# Altium project DBD_plasma.PrjPcb
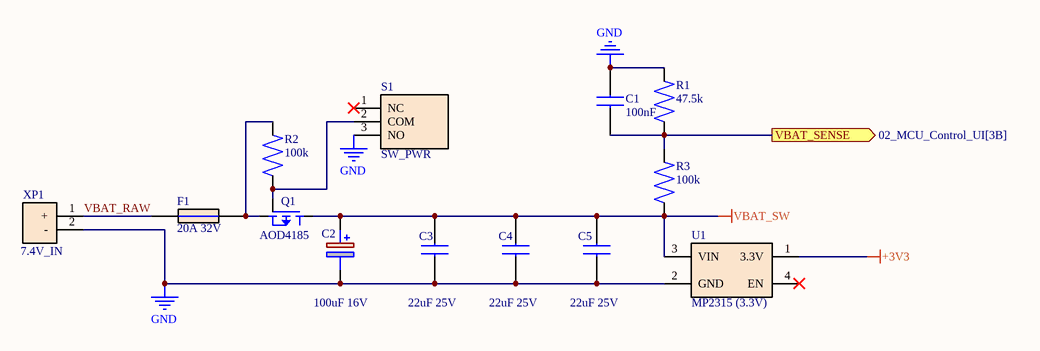
[diagram p0: 01_Power_Input.SchDoc]
6 sheets, 123 parts. Net scope: flat (ports and power ports of the same name join across sheets).
Board file: DBD_plasma.PcbDoc
Sheets:
  01_Power_Input.SchDoc
  02_MCU_Control_UI.SchDoc
  03_ZVS_PushPull.SchDoc
  04_HV_Bus_Sense.SchDoc
  05_SiC_Nanosecond_Stage.SchDoc
  06_Pneumatics.SchDoc

## Sheet 01_Power_Input.SchDoc
size A4; SheetNumber: 1; SheetTotal: 6

### Parts
C1  100nF  [CHIP_0603_SMD]
C2  100uF 16V  [CAP_ALU_SMD_D5.0_L5.4]
C3  22uF 25V  [CHIP_1210_3225]
C4  22uF 25V  [CHIP_1210_3225]
C5  22uF 25V  [CHIP_1210_3225]
F1  20A 32V  [FUSE_HOLDER_MINI_KEYSTONE_3544]
Q1  AOD4185  [TO-252-2L_DPAK_THERMAL]
R1  47.5k  [CHIP_0603_SMD]
R2  100k  [CHIP_0603_SMD]
R3  100k  [CHIP_0603_SMD]
S1  SW_PWR  [TNT_SW_SLIDE_2.5mm]
U1  MP2315 (3.3V)  [MODULE_DC-DC_MP2315_MINI_BUCK_THT]
XP1  7.4V_IN  [CONN_XT30PW-M_2P]

### Ports
VBAT_SENSE (out, see 02_MCU_Control_UI[3B])

### Nets
+3V3: U1.1(3.3V)
GND: C1.2 C2.2(-) C3.1 C4.1 C5.1 R1.2 S1.3(NO) U1.2(GND) XP1.2(-)
VBAT_SW: C2.1(+) C3.2 C4.2 C5.2 Q1.2(D) R3.1 U1.3(VIN)
VBAT_RAW: F1.1 XP1.1(+)
NetC1_1: C1.1 R1.1 R3.2 ; port VBAT_SENSE
NetF1_2: F1.2 Q1.3(S) R2.2
NetQ1_1: Q1.1(G) R2.1 S1.2(COM)

Not connected (* = marked no-connect by the designer): S1 1(NC)*; U1 4(EN)*

### Library data of the parts
C1 = CAP_0603_100nF_50V_X7R: Capacitor MLCC, Ceramic, 100 nF, 50 V, ±10%, X7R, SMD 0603, Samsung Electro-Mechanics; Part Number:: CL10B104KB8NNNC
C2 = CAP_POLY_SMD_100uF_16V_D6.3: Capacitor Polymer Aluminum, 100 uF, 16 V, ±20%, Low ESR, SMD Can 6.3x5.8 mm, Panasonic OS-CON / Nichicon
C3-C5 = CAP_1210_22uF_25V_X7R: Capacitor MLCC, Ceramic, 22 uF, 25 V, ±10%, X7R, SMD 1210, Murata Electronics
F1 = FUSE_MINI_BLADE_20A: Automotive Fuse Mini Blade, 20A, 32V DC, Fast-Acting, with PCB Holder/Clips
Q1 = MOSFET_P-CH_AOD4185: MOSFET P-Channel, -40V, -40A, 20 mOhm @ -10V, TO-252-2L (DPAK), Alpha & Omega Semiconductor
R1 = RES_0603_47.5k_1%: Resistor, 47.5 kOhm, ±1%, 0.1W (1/10W), SMD 0603, Thick Film, Yageo
R2 R3 = RES_0603_100k_1%: Resistor, 100 kOhm, ±1%, 0.1W (1/10W), SMD 0603, Thick Film, Yageo
S1 = SW_SLIDE_SPDT_SS12D00: Slide Switch, SPDT (1P2T), 50V DC 0.5A, Through-Hole (THT), Vertical, Actuator Height 6mm
U1 = MODULE_DC-DC_MP2315_3V3: DC-DC Step-Down Buck Converter Module, MP2315, Vin 4.5V-24V, Vout 3.3V 3A, Sub-Board PCB Mount
XP1 = CONN_XT30PW-M_2P: Connector DC Power, XT30 Male 90° (Right Angle) PCB Mount, 2-Pin, 30A Cont. / 50A Peak, Amass XT30PW-M

## Sheet 02_MCU_Control_UI.SchDoc
size A4; SheetNumber: 2; SheetTotal: 6
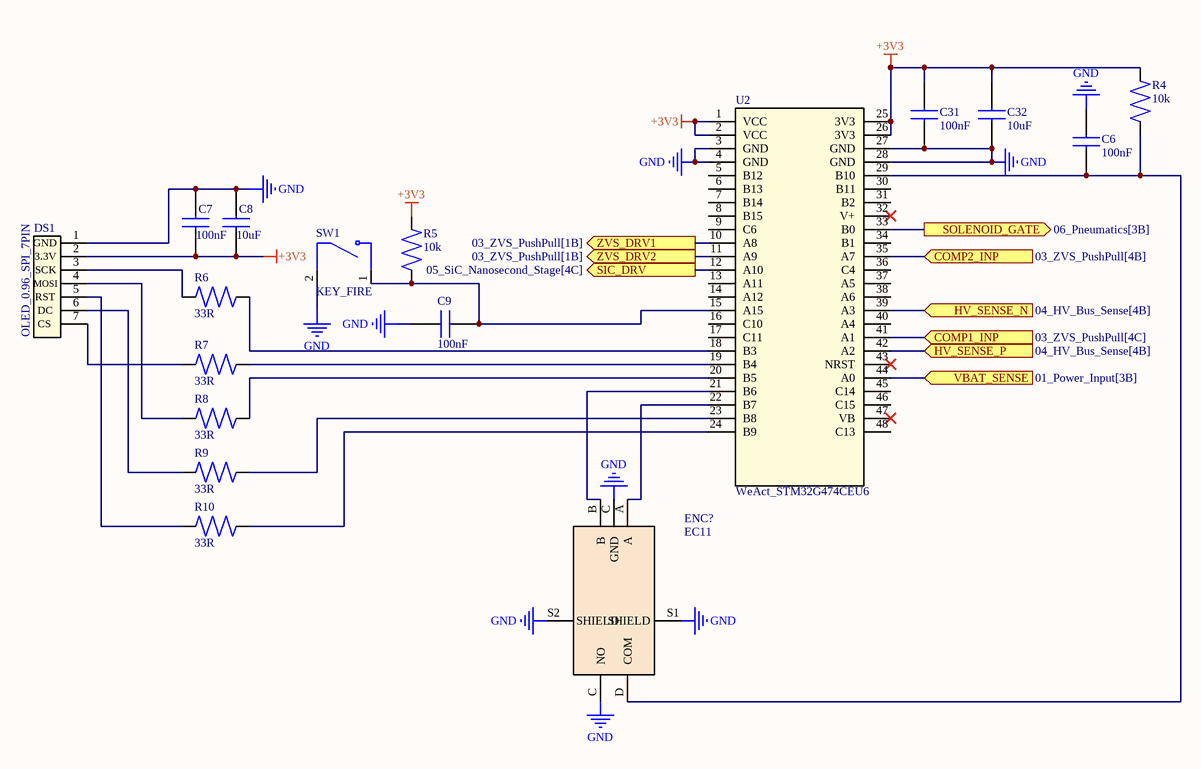
[diagram p1: 02_MCU_Control_UI.SchDoc]

### Parts
C6  100nF  [CHIP_0603_SMD]
C7  100nF  [CHIP_0603_SMD]
C8  10uF  [CHIP_0805_SMD]
C9  100nF  [CHIP_0603_SMD]
C31  100nF  [CHIP_0603_SMD]
C32  10uF  [CHIP_0805_SMD]
DS1  OLED_0.96_SPI_7PIN  [DISP_OLED_0.96_SSD1306_SPI_7PIN_THT]
ENC?  EC11  [ENC_EC11_VERTICAL_THT]
R4  10k  [CHIP_0603_SMD]
R5  10k  [CHIP_0603_SMD]
R6  33R  [CHIP_0603_SMD]
R7  33R  [CHIP_0603_SMD]
R8  33R  [CHIP_0603_SMD]
R9  33R  [CHIP_0603_SMD]
R10  33R  [CHIP_0603_SMD]
SW1  KEY_FIRE  [PAD_WIRE_2P_STRAIN_P2.54]
U2  WeAct_STM32G474CEU6  [MODULE_WEACT_STM32G474CEU6_DIP]

### Ports
COMP1_INP (in, see 03_ZVS_PushPull[4C]), COMP2_INP (in, see 03_ZVS_PushPull[4B]), HV_SENSE_N (in, see 04_HV_Bus_Sense[4B]), HV_SENSE_P (in, see 04_HV_Bus_Sense[4B]), SIC_DRV (out, see 05_SiC_Nanosecond_Stage[4C]), SOLENOID_GATE (out, see 06_Pneumatics[3B]), VBAT_SENSE (in, see 01_Power_Input[3B]), ZVS_DRV1 (out, see 03_ZVS_PushPull[1B]), ZVS_DRV2 (out, see 03_ZVS_PushPull[1B])

### Nets
+3V3: C7.1 C8.1 C31.2 C32.2 DS1.2(3.3V) R4.2 R5.2 U2.1(VCC) U2.2(VCC) U2.25(3V3) U2.26(3V3)
GND: C6.1 C7.2 C8.2 C9.1 C31.1 C32.1 DS1.1(GND) ENC?.C(GND) ENC?.S1(SHIELD) ENC?.S2(SHIELD) ENC?.С(NO) SW1.2 U2.3(GND) U2.4(GND) U2.27(GND) U2.28(GND)
NetC1_1: U2.44(A0) ; port VBAT_SENSE
NetC6_2: C6.2 ENC?.D(COM) R4.1 U2.29(B10)
NetC9_2: C9.2 R5.1 SW1.1 U2.15(A15)
NetD4_1: U2.35(A7) ; port COMP2_INP
NetD4_2: U2.41(A1) ; port COMP1_INP
NetDD1_2: U2.10(A8) ; port ZVS_DRV1
NetDD1_4: U2.11(A9) ; port ZVS_DRV2
NetDS1_3: DS1.3(SCK) R6.1
NetDS1_4: DS1.4(MOSI) R8.1
NetDS1_5: DS1.5(RST) R10.2
NetDS1_6: DS1.6(DC) R9.1
NetDS1_7: DS1.7(CS) R7.1
NetENC?_A: ENC?.A U2.22(B7)
NetENC?_B: ENC?.B U2.21(B6)
NetR6_2: R6.2 U2.18(B3)
NetR7_2: R7.2 U2.19(B4)
NetR8_2: R8.2 U2.20(B5)
NetR9_2: R9.2 U2.23(B8)
NetR10_1: R10.1 U2.24(B9)
NetR45_2: U2.33(B0) ; port SOLENOID_GATE
NetR47_2: U2.12(A10) ; port SIC_DRV
NetU2_39: U2.39(A3) ; port HV_SENSE_N
NetU2_42: U2.42(A2) ; port HV_SENSE_P

Not connected (* = marked no-connect by the designer): U2 5(B12_) 6(B13_) 7(B14_) 8(B15_) 9(C6) 13(A11) 14(A12) 16(C10) 17(C11) 30(B11) 31(B2) 32(V+)* 34(B1) 36(C4) 37(A5) 38(A6) 40(A4) 43(NRST)* 45(C14) 46(C15) 47(VB)* 48(C13)

### Library data of the parts
C6 C7 C9 C31 = CAP_0603_100nF_50V_X7R: as C1 on sheet 01_Power_Input
C8 C32 = CAP_0805_10uF_16V_X7R: Capacitor MLCC, Ceramic, 10 uF, 16 V, ±10%, X7R, SMD 0805, Hitano Enterprise; Part Number:: 0805B106K160NT
DS1 = OLED_0.96_SPI_7PIN: Fast monochrome screen (with a resolution of 128x64 pixels that is connected via a  seven-wire bus
ENC? = ENC_EC11_THT_SW: Rotary Encoder Incremental, 2-Bit Quadrature, with Push-Button Switch, 20 PPR, Through-Hole (THT), D-Shaft 20mm, Alps Alpine / Generic
R4 R5 = RES_0603_10k_1%: Resistor, 10 kOhm, ±1%, 0.1W (1/10W), 75V, SMD 0603, Thick Film, Hitano
R6-R10 = RES_0603_33R_1%: Resistor, 33 Ohm, ±1%, 0.1W (1/10W), SMD 0603, Thick Film, Yageo; Part Number:: RC0603FR-0733RL; Manufacturer:: Yageo
SW1 = SW_PUSH_OFF-ON_PANEL: Switch Tactile
U2 = WeAct_STM32G474CEU6: Arm Cortex-M4 core with DSP and FPU, 170MHz with 32Kbytes of Flash memory, Math Accelerator, Medium Analog level integration STM board

## Sheet 03_ZVS_PushPull.SchDoc
size A4; SheetNumber: 3; SheetTotal: 6
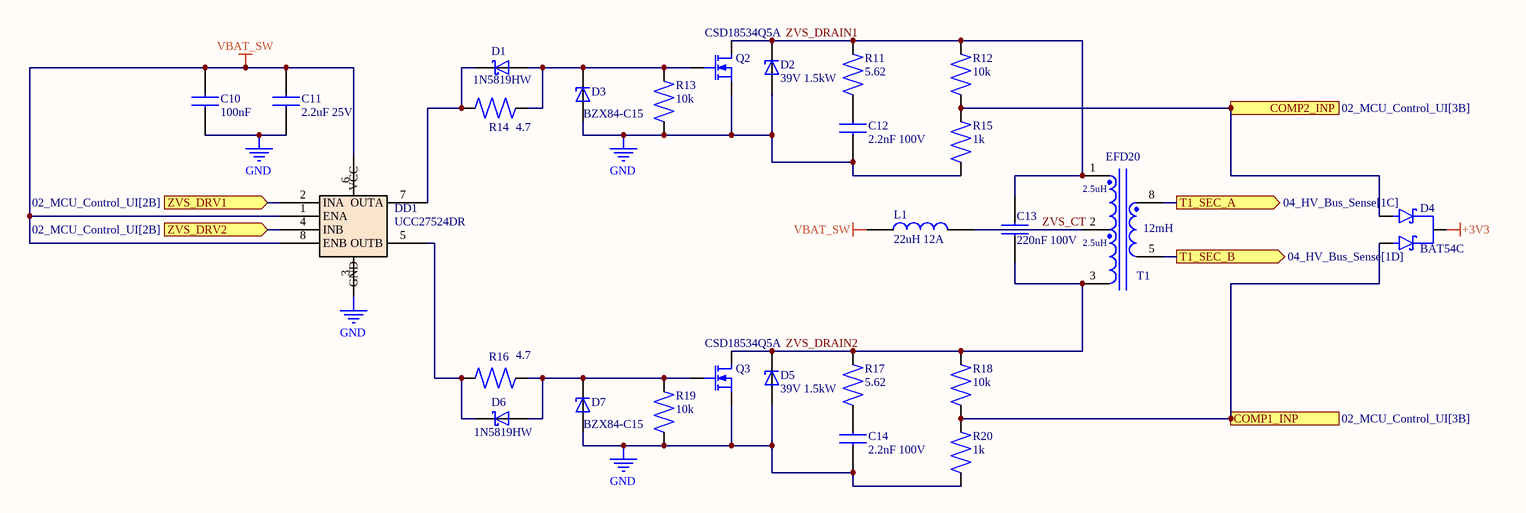
[diagram p2: 03_ZVS_PushPull.SchDoc]

### Parts
C10  100nF  [CHIP_0603_SMD]
C11  2.2uF 25V  [CHIP_0805_SMD]
C12  2.2nF 100V  [CHIP_1206_SMD]
C13  220nF 100V  [CAP_FILM_P15.0_CBB22_W8.5_MKP]
C14  2.2nF 100V  [CHIP_1206_SMD]
D1  1N5819HW  [SOD-123_2P_SMD]
D2  39V 1.5kW  [DIODE_DO-214AB_SMC]
D3  BZX84-C15  [SOT-23_3P_SMD]
D4  BAT54C  [SOT-23_3P_SMD]
D5  39V 1.5kW  [DIODE_DO-214AB_SMC]
D6  1N5819HW  [SOD-123_2P_SMD]
D7  BZX84-C15  [SOT-23_3P_SMD]
DD1  UCC27524DR  [SOIC-8_1.27_4.9x3.9mm]
L1  22uH 12A  [IND_SRP1265A_13.5x12.5_HANDSOLDER]
Q2  CSD18534Q5A  [SON-8_5x6_CSD18534Q5A_THERMAL]
Q3  CSD18534Q5A  [SON-8_5x6_CSD18534Q5A_THERMAL]
R11  5.62  [CHIP_1206_SMD]
R12  10k  [CHIP_0603_SMD]
R13  10k  [CHIP_0603_SMD]
R14  4.7  [CHIP_0603_SMD]
R15  1k  [CHIP_0603_SMD]
R16  4.7  [CHIP_0603_SMD]
R17  5.62  [CHIP_1206_SMD]
R18  10k  [CHIP_0603_SMD]
R19  10k  [CHIP_0603_SMD]
R20  1k  [CHIP_0603_SMD]
T1  EFD20  [TRANS_EFD20_CORETECH_BH-EFD20-1-8R_THT]

### Ports
COMP1_INP (out, see 02_MCU_Control_UI[3B]), COMP2_INP (out, see 02_MCU_Control_UI[3B]), T1_SEC_A (out, see 04_HV_Bus_Sense[1C]), T1_SEC_B (out, see 04_HV_Bus_Sense[1D]), ZVS_DRV1 (in, see 02_MCU_Control_UI[2B]), ZVS_DRV2 (in, see 02_MCU_Control_UI[2B])

### Nets
+3V3: D4.3(K)
GND: C10.1 C11.1 C12.1 C14.1 D2.2(A) D3.1(A) D5.2(A) D7.1(A) DD1.3(GND) Q2.1(SR) Q3.1(SR) R13.1 R15.1 R19.1 R20.1
VBAT_SW: C10.2 C11.2 DD1.1(ENA) DD1.6(VCC) DD1.8(ENB) L1.1
ZVS_CT: L1.2 T1.2(TAP)
ZVS_DRAIN1: C13.2 D2.1(K) Q2.3(DR) R11.2 R12.2 T1.1(PRI1)
ZVS_DRAIN2: C13.1 D5.1(K) Q3.3(DR) R17.2 R18.2 T1.3(PRI2)
NetD1_1: D1.1(K) DD1.7(OUTA) R14.1
NetD1_2: D1.2(A) D3.3(K) Q2.2(G) R13.2 R14.2
NetD4_1: D4.1(A1) R12.1 R15.2 ; port COMP2_INP
NetD4_2: D4.2(A2) R18.1 R20.2 ; port COMP1_INP
NetD6_1: D6.1(K) DD1.5(OUTB) R16.1
NetD6_2: D6.2(A) D7.3(K) Q3.2(G) R16.2 R19.2
NetD10_2: T1.8(SEC1) ; port T1_SEC_A
NetD11_2: T1.5(SEC2) ; port T1_SEC_B
NetDD1_2: DD1.2(INA) ; port ZVS_DRV1
NetDD1_4: DD1.4(INB) ; port ZVS_DRV2

Not connected (* = marked no-connect by the designer): C12 2; C14 2; R11 1; R17 1

### Notes on the sheet
- (in symbol TRANS_EFD20_CUSTOM) 2.5uH; 12mH

### Library data of the parts
C10 = CAP_0603_100nF_50V_X7R: as C1 on sheet 01_Power_Input
C11 = CAP_0805_2.2uF_25V_X7R: Capacitor MLCC, Ceramic, 2.2 uF, 25 V, ±10%, X7R, SMD 0805, Hitano Enterprise
C12 C14 = CAP_1206_2.2nF_100V_C0G: Capacitor MLCC, Ceramic, 2.2 nF, 100 V, ±5%, C0G/NP0, SMD 1206, High Frequency Snubber, Yageo
C13 = CAP_FILM_CBB22_220nF_630V_P15: Capacitor Film, Metallized Polypropylene (MKP/CBB22), 0.22 uF (220 nF), 630 VDC, ±5%, Radial THT, Pitch 15.0mm, ZVS Primary Tank
D1 D6 = DIODE_SCHOTTKY_1N5819HW: Schottky Barrier Diode, 40V, 1A, Vf=0.45V @ 1A, SOD-123
D2 D5 = DIODE_TVS_SMC_1.5SMC39AQ: TVS Diode Unidirectional, 33.3V Vwm, 1500W (10/1000us), DO-214AB (SMC), Automotive Qualified
D3 D7 = DIODE_ZENER_BZX84-C15_SOT23: Zener Diode, 15V, 250mW, ±5%, SOT-23 (TO-236AB), Gate Protection, Nexperia / NXP
D4 = DIODE_ARRAY_BAT54C_SOT23: Dual Schottky Barrier Diode, Common Cathode, 30V, 200mA, Vf=0.32V @ 2mA, SOT-23
DD1 = IC_DRIVER_UCC27524DR: Dual 5A High-Speed Low-Side Gate Driver, 4.5V to 18V VDD, Non-Inverting, SOIC-8, Texas Instruments
L1 = IND_SMD_22uH_12A: Inductor Power Shielded SMD, 22 uH, ±20%, 12A Irms, Ferrite Core, 13.5x12.5x6.2, SRP1265A-220M
Q2 Q3 = MOSFET_N_60V_CSD18534Q5A: MOSFET N-Channel, 60V, 69A, 3.5 mOhm, Logic Level, SON-8 (DFN 5x6), Texas Instruments
R11 R17 = RES_1206_5.62R_1%: Resistor, 5.62 Ohm, ±1%, 0.25W (1/4W), 200V, SMD 1206, Thick Film, Panasonic
R12 R13 R18 R19 = RES_0603_10k_1%: as R4 on sheet 02_MCU_Control_UI
R14 R16 = RES_0603_4R7: Resistor, 4.7 Ohm, ±5%, 0.1W (1/10W), 50V, SMD 0603, Gate Drive Series, KOME
R15 R20 = RES_0603_1k_1%: Resistor, 1 kOhm, ±1%, 0.1W (1/10W), 75V, SMD 0603, Thick Film, Yageo
T1 = TRANS_EFD20_CUSTOM: Custom ZVS Step-Up Transformer, EFD20 Core (N87/PC40), 8-Pin Bobbin, Push-Pull Center-Tapped Primary

## Sheet 04_HV_Bus_Sense.SchDoc
size A4; SheetNumber: 4; SheetTotal: 6
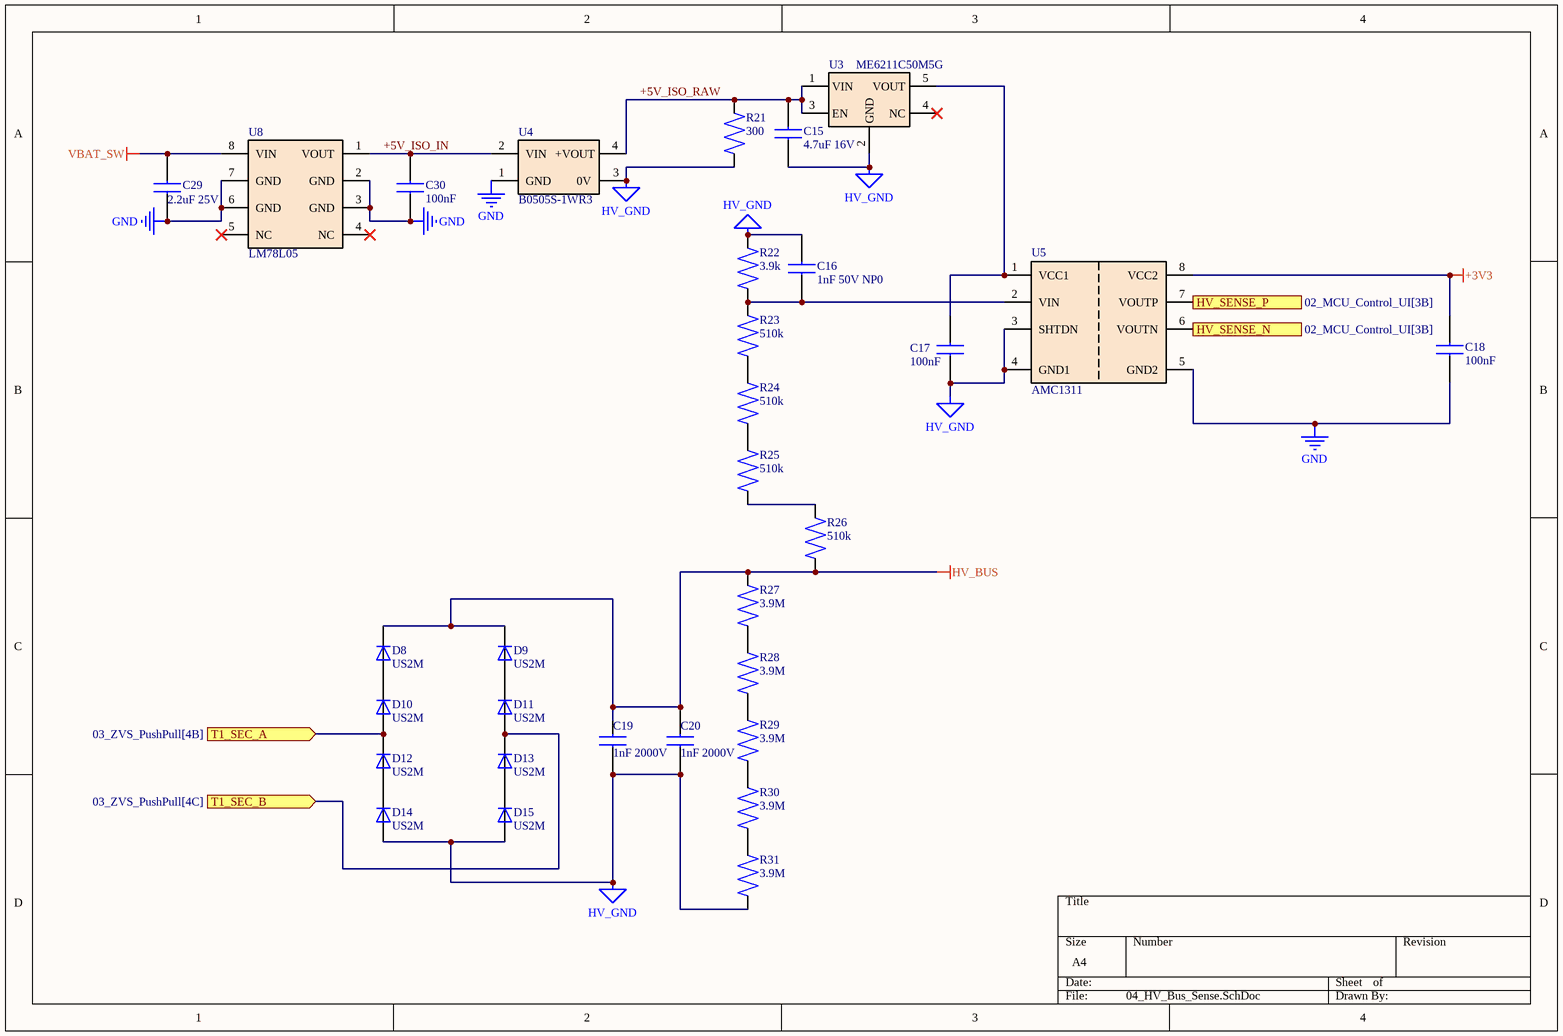
[diagram p3: 04_HV_Bus_Sense.SchDoc]

### Parts
C15  4.7uF 16V  [CHIP_0805_SMD]
C16  1nF 50V NP0  [CHIP_0603_SMD]
C17  100nF  [CHIP_0603_SMD]
C18  100nF  [CHIP_0603_SMD]
C19  1nF 2000V  [CAP_FILM_P15.0_CBB81_HEAVY_DUTY]
C20  1nF 2000V  [CAP_FILM_P15.0_CBB81_HEAVY_DUTY]
C29  2.2uF 25V  [CHIP_0805_SMD]
C30  100nF  [CHIP_0603_SMD]
D8  US2M  [DIODE_DO-214AC_SMA]
D9  US2M  [DIODE_DO-214AC_SMA]
D10  US2M  [DIODE_DO-214AC_SMA]
D11  US2M  [DIODE_DO-214AC_SMA]
D12  US2M  [DIODE_DO-214AC_SMA]
D13  US2M  [DIODE_DO-214AC_SMA]
D14  US2M  [DIODE_DO-214AC_SMA]
D15  US2M  [DIODE_DO-214AC_SMA]
R21  300  [CHIP_0805_SMD]
R22  3.9k  [CHIP_0603_SMD]
R23  510k  [CHIP_1206_SMD]
R24  510k  [CHIP_1206_SMD]
R25  510k  [CHIP_1206_SMD]
R26  510k  [CHIP_1206_SMD]
R27  3.9M  [CHIP_1206_SMD]
R28  3.9M  [CHIP_1206_SMD]
R29  3.9M  [CHIP_1206_SMD]
R30  3.9M  [CHIP_1206_SMD]
R31  3.9M  [CHIP_1206_SMD]
U3  ME6211C50M5G  [SOT-23-5_M5_HANDSOLDER]
U4  B0505S-1WR3  [CONV_DC-DC_MORNSUN_SIP-4_11.6x6.0]
U5  AMC1311  [SOIC-8-DWV_WIDE_HANDSOLDER]
U8  LM78L05  [SOIC-8_1.27_4.9x3.9mm]

### Ports
HV_SENSE_N (out, see 02_MCU_Control_UI[3B]), HV_SENSE_P (out, see 02_MCU_Control_UI[3B]), T1_SEC_A (in, see 03_ZVS_PushPull[4B]), T1_SEC_B (in, see 03_ZVS_PushPull[4C])

### Nets
+3V3: C18.2 U5.8(VCC2)
GND: C18.1 C29.1 C30.1 U4.1(GND) U5.5(GND2) U8.2(GND) U8.3(GND) U8.6(GND) U8.7(GND)
HV_BUS: C19.2 C20.2 D8.1(K) D9.1(K) R26.1 R27.2
HV_GND: C15.1 C16.2 C17.1 C19.1 C20.1 D14.2(A) D15.2(A) R21.1 R22.2 R31.1 U3.2(GND) U4.3(0V) U5.3(SHTDN) U5.4(GND1)
VBAT_SW: C29.2 U8.8(VIN)
+5V_ISO_IN: C30.2 U4.2(VIN) U8.1(VOUT)
+5V_ISO_RAW: C15.2 R21.2 U3.1(VIN) U3.3(EN) U4.4(+VOUT)
NetC16_1: C16.1 R22.1 R23.2 U5.2(VIN)
NetC17_2: C17.2 U3.5(VOUT) U5.1(VCC1)
NetD8_2: D8.2(A) D10.1(K)
NetD9_2: D9.2(A) D11.1(K)
NetD10_2: D10.2(A) D12.1(K) ; port T1_SEC_A
NetD11_2: D11.2(A) D13.1(K) ; port T1_SEC_B
NetD12_2: D12.2(A) D14.1(K)
NetD13_2: D13.2(A) D15.1(K)
NetR23_1: R23.1 R24.2
NetR24_1: R24.1 R25.2
NetR25_1: R25.1 R26.2
NetR27_1: R27.1 R28.2
NetR28_1: R28.1 R29.2
NetR29_1: R29.1 R30.2
NetR30_1: R30.1 R31.2
NetU2_39: U5.6(VOUTN) ; port HV_SENSE_N
NetU2_42: U5.7(VOUTP) ; port HV_SENSE_P

Not connected (* = marked no-connect by the designer): U3 4(NC)*; U8 4(NC)* 5(NC)*

### Library data of the parts
C15 = CAP_0805_4.7uF_16V_X7R: Capacitor MLCC, Ceramic, 4.7 uF, 16 V, ±10%, X7R, SMD 0805, Bypass / Decoupling, Samsung / Murata
C16 = CAP_0603_1nF_50V_NP0: Capacitor MLCC, Ceramic, 1 nF, 50 V, ±5%, C0G/NP0, SMD 0603, High Frequency Filter, Samsung Electro-Mechanics
C17 C18 C30 = CAP_0603_100nF_50V_X7R: as C1 on sheet 01_Power_Input
C19 C20 = CAP_FILM_CBB81_1nF_2000V: Capacitor Film, Metallized Polypropylene (PP), 1nF, 2000 VDC (2 kV), ±5%, Radial THT, High Pulse / Snubber, CBB81
C29 = CAP_0805_2.2uF_25V_X7R: as C11 on sheet 03_ZVS_PushPull
D8-D15 = DIODE_ULTRAFAST_US2M_SMA: Ultrafast High Voltage Surface Mount Rectifier, 1000V, 2A, trr=75ns, Vf=1.7V, SMA (DO-214AC)
R21 = RES_0805_300R_1%: Resistor, 300 Ohm, ±1%, 0.125W (1/8W), 150V, SMD 0805, Thick Film, Yageo
R22 = RES_0603_3.9k_1%: Resistor, 3.9 kOhm, ±1%, 0.1W (1/10W), 75V, SMD 0603, Thick Film, Yageo
R23-R26 = RES_1206_510k_1%: Resistor, 510 kOhm, ±1%, 0.25W (1/4W), 200V, SMD 1206, High Voltage Divider, Thick Film, Yageo
R27-R31 = RES_1206_3.9M_5%: Resistor, 3.9 MOhm, ±5%, 0.25W (1/4W), 200V, SMD 1206, Bleeder / High Resistance, Thick Film, Hitano
U3 = IC_REG_LDO_ME6211C50M5G: LDO Voltage Regulator, Fixed 5.0V, 500mA, Low Noise, High PSRR, SOT-23-5, Microne
U4 = MODULE_DCDC_B0505S-1WR3: Isolated DC-DC Converter, 5V In, 5V Out, 1W (200mA), 3000 VDC Isolation, Unregulated, SIP-4, Mornsun
U5 = IC_ISO_AMP_AMC1311BDWVR: Precision Isolated Amplifier, 0V to 2V Input, 5kVrms Isolation, High CMTI (100kV/us), SOIC-8 Wide (DWV), Texas Instruments
U8 = MODULE_LDO_LM78L05_SO8: IC REG LINEAR 5V 100MA SOIC-8, Vin up to 30V

## Sheet 05_SiC_Nanosecond_Stage.SchDoc
size A4; SheetNumber: 5; SheetTotal: 6
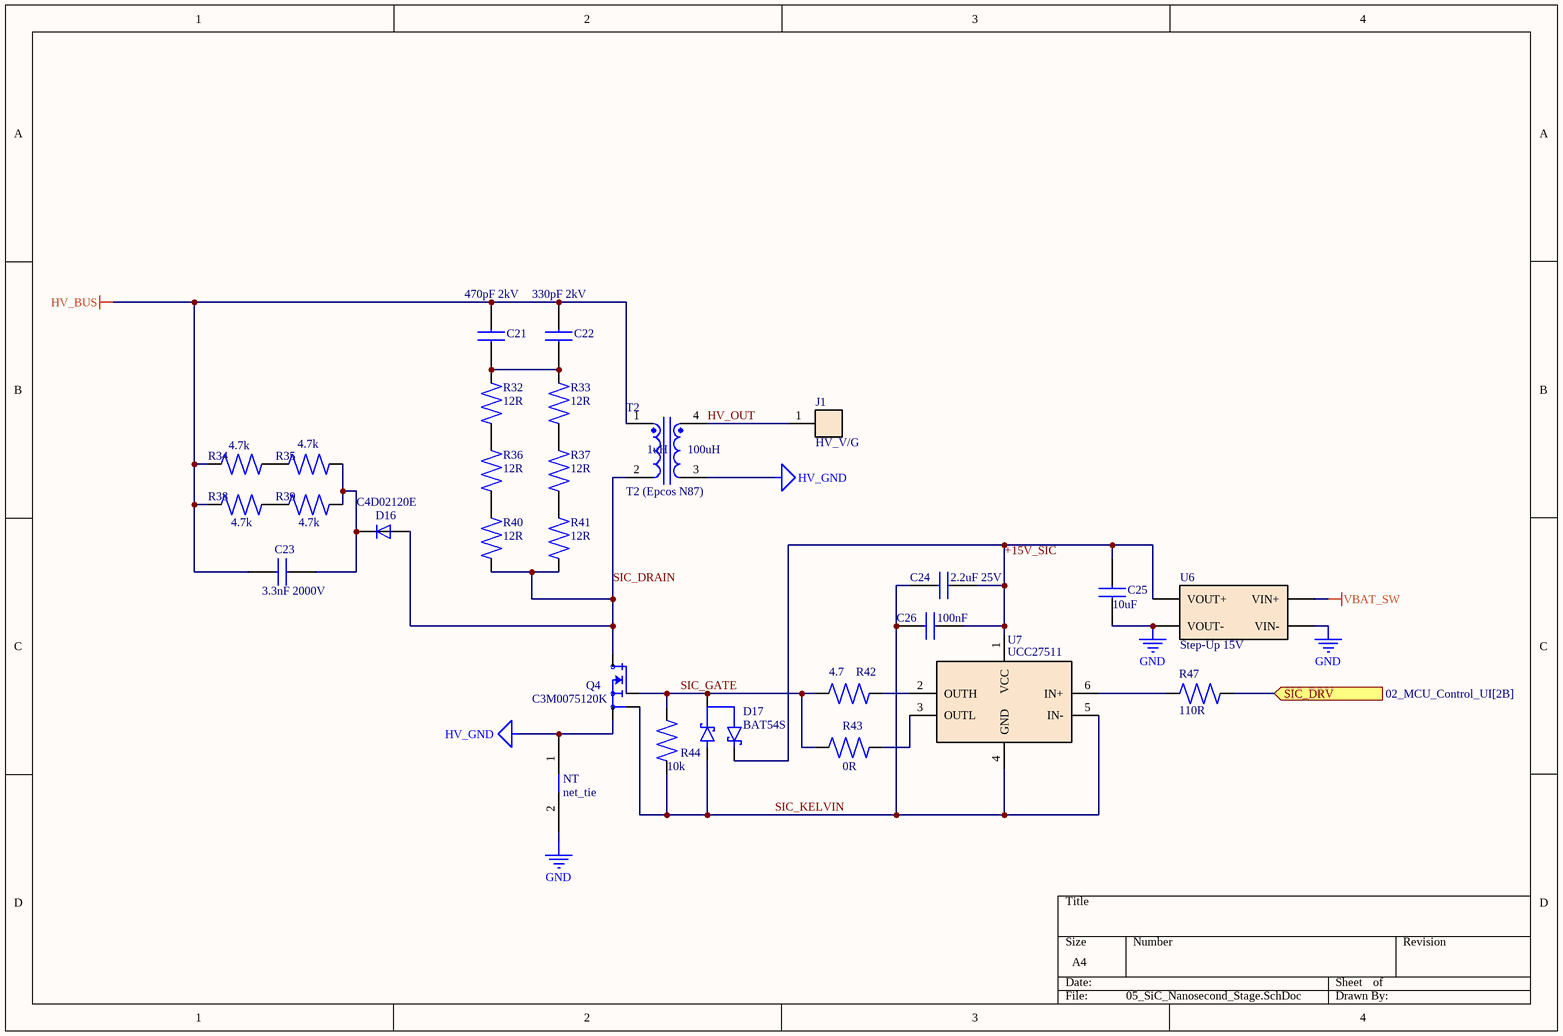
[diagram p4: 05_SiC_Nanosecond_Stage.SchDoc]

### Parts
C21  470pF 2kV  [CAP_FILM_P15.0_CBB81_HEAVY_DUTY]
C22  330pF 2kV  [CAP_FILM_P15.0_CBB81_HEAVY_DUTY]
C23  3.3nF 2000V  [CAP_FILM_P15.0_CBB81_HEAVY_DUTY]
C24  2.2uF 25V  [CHIP_0805_SMD]
C25  10uF  [CHIP_0805_SMD]
C26  100nF  [CHIP_0603_SMD]
D16  C4D02120E  [TO-252-2L_DPAK_THERMAL]
D17  BAT54S  [SOT-23_3P_SMD]
J1  HV_V/G  [PAD_HV_UL3239_28AWG_ROUND]
NT  net_tie  [NET_TIE_SMD]  (net tie, no BOM)
Q4  C3M0075120K  [TO-247-4_WOLFSPEED_SLOTTED_VERT]
R32  12R  [RES_2512_6.3x3.2_HANDSOLDER]
R33  12R  [RES_2512_6.3x3.2_HANDSOLDER]
R34  4.7k  [CHIP_1206_SMD]
R35  4.7k  [CHIP_1206_SMD]
R36  12R  [RES_2512_6.3x3.2_HANDSOLDER]
R37  12R  [RES_2512_6.3x3.2_HANDSOLDER]
R38  4.7k  [CHIP_1206_SMD]
R39  4.7k  [CHIP_1206_SMD]
R40  12R  [RES_2512_6.3x3.2_HANDSOLDER]
R41  12R  [RES_2512_6.3x3.2_HANDSOLDER]
R42  4.7  [CHIP_0603_SMD]
R43  0R  [CHIP_1206_SMD]
R44  10k  [CHIP_0603_SMD]
R47  110R  [CHIP_0805_SMD]
T2  T2 (Epcos N87)  [TRANS_AUTOTRANS_T2_EPCOS_R20_N87]
U6  Step-Up 15V  [MODULE_DC-DC_MT3608_BOOST_THT]
U7  UCC27511  [SOT-23-6_DBV_HANDSOLDER]

### Ports
SIC_DRV (in, see 02_MCU_Control_UI[2B])

### Nets
GND: C25.1 NT.2 U6.2(VIN-) U6.4(VOUT-)
HV_BUS: C21.2 C22.2 C23.1 R34.1 R38.1 T2.1(+850V)
HV_GND: NT.1 Q4.2(S) T2.3(HV_GND)
VBAT_SW: U6.1(VIN+)
+15V_SIC: C24.1 C25.2 C26.1 D17.2(K2) U6.3(VOUT+) U7.1(VCC)
HV_OUT: J1.1 T2.4(SEC+)
SIC_DRAIN: D16.1(A) Q4.1(D) R40.1 R41.1 T2.2(DRAIN)
SIC_GATE: D17.3(K1+A2) Q4.4(G) R42.1 R43.1 R44.2
SIC_KELVIN: C24.2 C26.2 D17.1(A1) Q4.3(KS) R44.1 U7.4(GND) U7.5(IN-)
NetC21_1: C21.1 C22.1 R32.2 R33.2
NetC23_2: C23.2 D16.2(K) R35.2 R39.2
NetR32_1: R32.1 R36.2
NetR33_1: R33.1 R37.2
NetR34_2: R34.2 R35.1
NetR36_1: R36.1 R40.2
NetR37_1: R37.1 R41.2
NetR38_2: R38.2 R39.1
NetR42_2: R42.2 U7.2(OUTH)
NetR43_2: R43.2 U7.3(OUTL)
NetR47_1: R47.1 U7.6(IN+)
NetR47_2: R47.2 ; port SIC_DRV

### Notes on the sheet
- (in symbol TRANS_AUTOTRANS_T2_N87) 1uH; 100uH

### Library data of the parts
C21 = CAP_FILM_CBB81_470pF_2000V: Capacitor Film, Polypropylene (PP), 470 pF, 2000 VDC, ±5%, Radial THT, Pitch 15mm, CBB81
C22 = CAP_FILM_CBB81_330pF_2000V: Capacitor Film, Polypropylene (PP), 330 pF, 2000 VDC, ±5%, Radial THT, Pitch 15mm, CBB81
C23 = CAP_FILM_CBB81_3.2nF_2000V: Capacitor Film, Metallized Polypropylene (PP), 3.2 nF (3.3 nF), 2000 VDC (2 kV), ±5%, Radial THT, High Pulse / Resonant Tank, CBB81
C24 = CAP_0805_2.2uF_25V_X7R: as C11 on sheet 03_ZVS_PushPull
C25 = CAP_0805_10uF_16V_X7R: as C8 on sheet 02_MCU_Control_UI
C26 = CAP_0603_100nF_50V_X7R: as C1 on sheet 01_Power_Input
D16 = DIODE_SIC_C4D02120E_TO252: SiC Schottky Diode, 1200V, 2A, Zero Recovery, TO-252-2 (DPAK), Pin 1: Anode, Pin 2: Cathode (Tab)
D17 = DIODE_SCHOTTKY_BAT54S_SOT23: Schottky Barrier Diode Pair, 30V 200mA, Dual Series Array, SOT-23 (Pin 1: A1, Pin 2: K2, Pin 3: Common)
J1 = PAD_HV_TERMINAL_1P: High Voltage Solder Pad / Wire Terminal, Single Pin THT, Hole D=1.8mm, Pad D=3.5mm
NT = NET_TIE_SMD
Q4 = MOSFET_N-CH_C3M0075120K_TO247-4: SiC Power MOSFET N-CH, 1200V, 30A, 75 mOhm, Kelvin Source, TO-247-4, Wolfspeed / Cree
R32 R33 R36 R37 R40 R41 = RES_2512_12R_1W_5%: Resistor, 12 Ohm, ±5%, 1W, 200V, SMD 2512, High Power Pulse Snubber, Thick Film, UniOhm / Yageo
R34 R35 R38 R39 = RES_1206_4.7k_1%: Resistor, 4.7 kOhm, ±1%, 0.25W (1/4W), 200V, SMD 1206, Thick Film, Hitano
R42 = RES_0603_4R7: as R14 on sheet 03_ZVS_PushPull
R43 = RES_1206_0R: just in case
R44 = RES_0603_10k_1%: as R4 on sheet 02_MCU_Control_UI
R47 = RES_0805_110R_0.1%: Resistor Thin Film, 110 Ohm, ±0.1%, 0.125W (1/8W), 150V, SMD 0805, High Precision Gate Resistor, Yageo
T2 = TRANS_AUTOTRANS_T2_N87: Pulse Autotransformer, Ferrite Ring Epcos B64290-L632-X87 (N87), Pri: Braid 3.0mm (1-2T), Sec: UL3239 28AWG (10-12T)
U6 = MODULE_DCDC_MT3608_STEP-UP: Miniature DC-DC Step-Up Boost Converter Module, Vin 2-24V, Vout Adj 5-28V (Preset to 15V), 2A Max, MT3608
U7 = IC_GATE_DRIVER_UCC27511DBVR: Single-Channel High-Speed Low-Side Gate Driver, 4A Source / 8A Sink, Split Outputs (OUTH/OUTL), 4.5V to 18V, SOT-23-6, Texas Instruments

## Sheet 06_Pneumatics.SchDoc
size A4; SheetNumber: 6; SheetTotal: 6
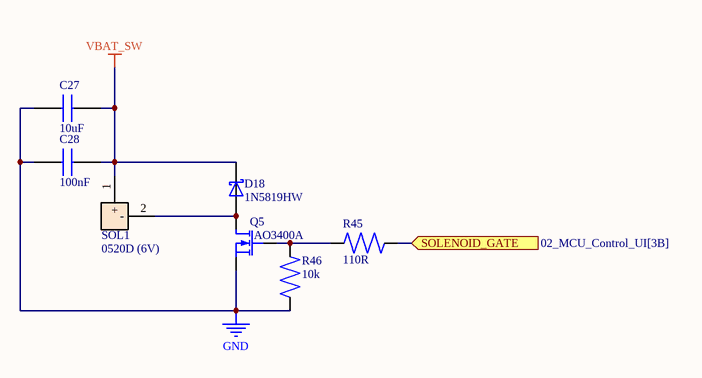
[diagram p5: 06_Pneumatics.SchDoc]

### Parts
C27  10uF  [CHIP_0805_SMD]
C28  100nF  [CHIP_0603_SMD]
D18  1N5819HW  [SOD-123_2P_SMD]
Q5  AO3400A  [SOT-23_3P_SMD]
R45  110R  [CHIP_0805_SMD]
R46  10k  [CHIP_0603_SMD]
SOL1  0520D (6V)  [PAD_2P_THT_P2.54MM]

### Ports
SOLENOID_GATE (in, see 02_MCU_Control_UI[3B])

### Nets
GND: C27.1 C28.1 Q5.2(SR) R46.1
VBAT_SW: C27.2 C28.2 D18.1(K) SOL1.1(+)
NetD18_2: D18.2(A) Q5.3(DR) SOL1.2(-)
NetQ5_1: Q5.1(G) R45.1 R46.2
NetR45_2: R45.2 ; port SOLENOID_GATE

### Library data of the parts
C27 = CAP_0805_10uF_16V_X7R: as C8 on sheet 02_MCU_Control_UI
C28 = CAP_0603_100nF_50V_X7R: as C1 on sheet 01_Power_Input
D18 = DIODE_SCHOTTKY_1N5819HW: as D1 on sheet 03_ZVS_PushPull
Q5 = MOSFET_N-CH_AO3400A_SOT23: MOSFET N-Channel, 30V, 5.7A, 28 mOhm @ 4.5V, Logic Level, SOT-23 (TO-236AB), Alpha & Omega Semiconductor
R45 = RES_0805_110R_0.1%: as R47 on sheet 05_SiC_Nanosecond_Stage
R46 = RES_0603_10k_1%: as R4 on sheet 02_MCU_Control_UI
SOL1 = ACTUATOR_SOLENOID_0520D_DC6V: Miniature Micro Solenoid Air Valve, 2-Position 2-Way Normally Closed (N/C), DC 3V - 6V, Gas Cutoff, 0520D

## Nets that join several sheets
+3V3: 01_Power_Input (U1.1), 02_MCU_Control_UI (11 pins), 03_ZVS_PushPull (D4.3), 04_HV_Bus_Sense (C18.2 U5.8)
GND: 01_Power_Input (9 pins), 02_MCU_Control_UI (16 pins), 03_ZVS_PushPull (15 pins), 04_HV_Bus_Sense (9 pins), 05_SiC_Nanosecond_Stage (C25.1 NT.2 U6.2 U6.4), 06_Pneumatics (C27.1 C28.1 Q5.2 R46.1)
HV_BUS: 04_HV_Bus_Sense (6 pins), 05_SiC_Nanosecond_Stage (6 pins)
HV_GND: 04_HV_Bus_Sense (14 pins), 05_SiC_Nanosecond_Stage (NT.1 Q4.2 T2.3)
VBAT_SW: 01_Power_Input (7 pins), 03_ZVS_PushPull (6 pins), 04_HV_Bus_Sense (C29.2 U8.8), 05_SiC_Nanosecond_Stage (U6.1), 06_Pneumatics (C27.2 C28.2 D18.1 SOL1.1)
NetC1_1: 01_Power_Input (C1.1 R1.1 R3.2), 02_MCU_Control_UI (U2.44)
NetD4_1: 02_MCU_Control_UI (U2.35), 03_ZVS_PushPull (D4.1 R12.1 R15.2)
NetD4_2: 02_MCU_Control_UI (U2.41), 03_ZVS_PushPull (D4.2 R18.1 R20.2)
NetD10_2: 03_ZVS_PushPull (T1.8), 04_HV_Bus_Sense (D10.2 D12.1)
NetD11_2: 03_ZVS_PushPull (T1.5), 04_HV_Bus_Sense (D11.2 D13.1)
NetDD1_2: 02_MCU_Control_UI (U2.10), 03_ZVS_PushPull (DD1.2)
NetDD1_4: 02_MCU_Control_UI (U2.11), 03_ZVS_PushPull (DD1.4)
NetR45_2: 02_MCU_Control_UI (U2.33), 06_Pneumatics (R45.2)
NetR47_2: 02_MCU_Control_UI (U2.12), 05_SiC_Nanosecond_Stage (R47.2)
NetU2_39: 02_MCU_Control_UI (U2.39), 04_HV_Bus_Sense (U5.6)
NetU2_42: 02_MCU_Control_UI (U2.42), 04_HV_Bus_Sense (U5.7)